# Altium schematic sheet led.SchDoc
size A4; SheetNumber: 9; SheetTotal: 12
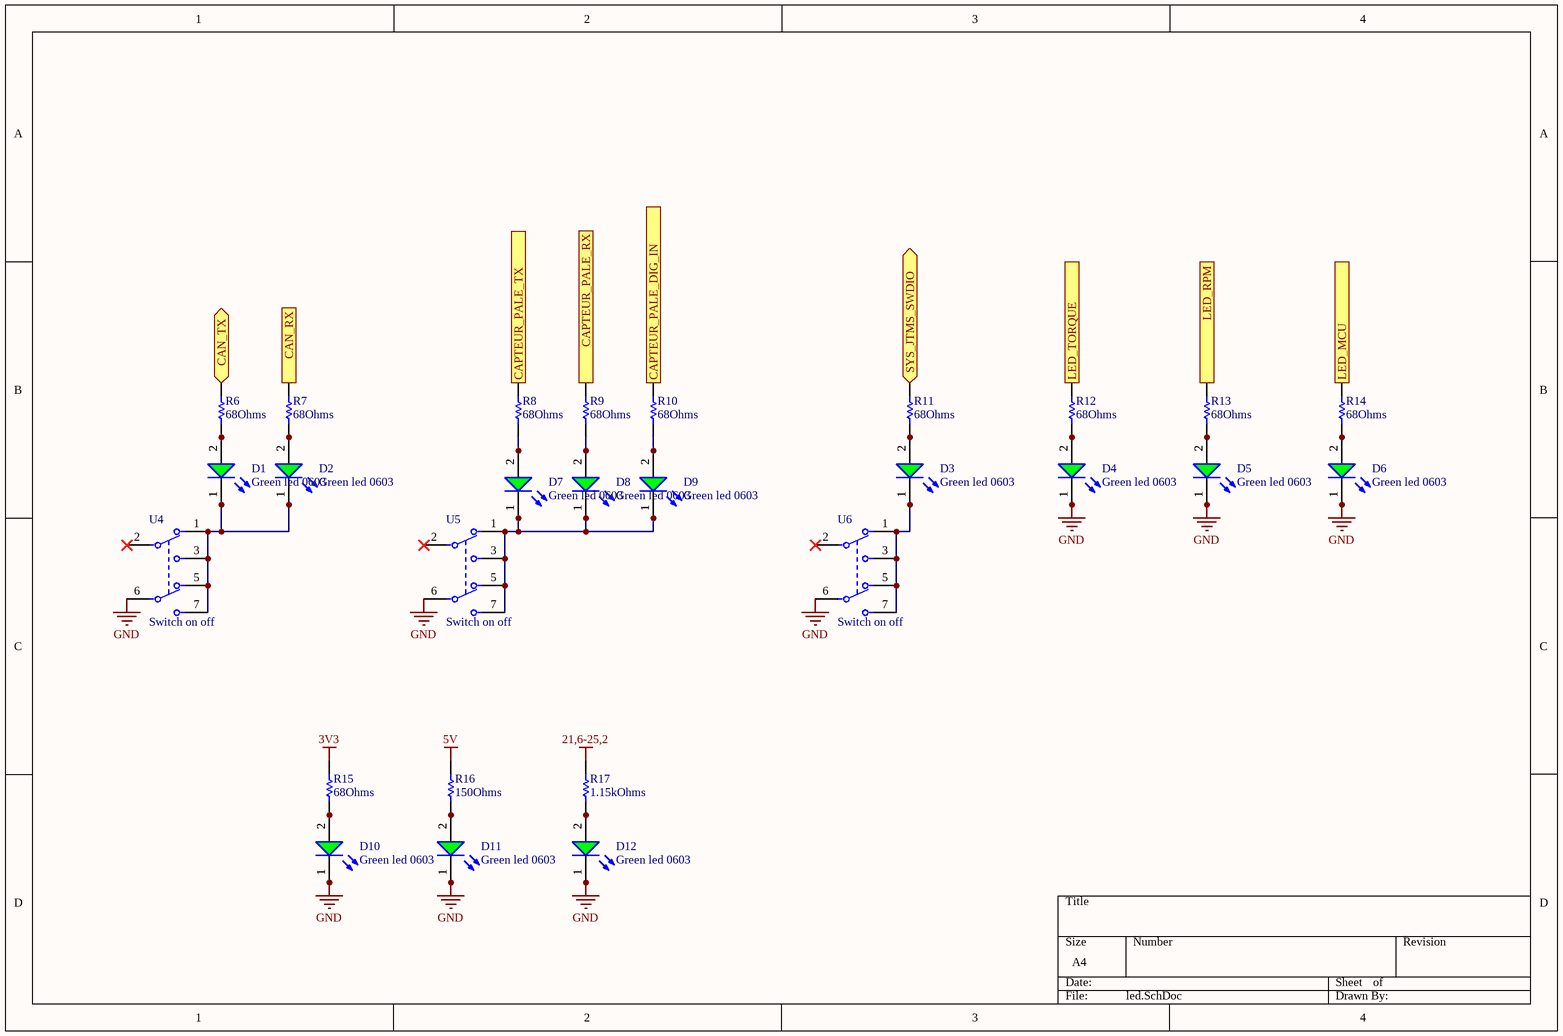
[diagram p0: led.SchDoc]

## Parts
D1  Green led 0603  [WL-SMCW_0603_150060xx75000]
D2  Green led 0603  [WL-SMCW_0603_150060xx75000]
D3  Green led 0603  [WL-SMCW_0603_150060xx75000]
D4  Green led 0603  [WL-SMCW_0603_150060xx75000]
D5  Green led 0603  [WL-SMCW_0603_150060xx75000]
D6  Green led 0603  [WL-SMCW_0603_150060xx75000]
D7  Green led 0603  [WL-SMCW_0603_150060xx75000]
D8  Green led 0603  [WL-SMCW_0603_150060xx75000]
D9  Green led 0603  [WL-SMCW_0603_150060xx75000]
D10  Green led 0603  [WL-SMCW_0603_150060xx75000]
D11  Green led 0603  [WL-SMCW_0603_150060xx75000]
D12  Green led 0603  [WL-SMCW_0603_150060xx75000]
R6  68Ohms  [RESC1005X40X25LL05T10]
R7  68Ohms  [RESC1005X40X25LL05T10]
R8  68Ohms  [RESC1005X40X25LL05T10]
R9  68Ohms  [RESC1005X40X25LL05T10]
R10  68Ohms  [RESC1005X40X25LL05T10]
R11  68Ohms  [RESC1005X40X25LL05T10]
R12  68Ohms  [RESC1005X40X25LL05T10]
R13  68Ohms  [RESC1005X40X25LL05T10]
R14  68Ohms  [RESC1005X40X25LL05T10]
R15  68Ohms  [RESC1005X40X25LL05T10]
R16  150Ohms  [RESC1005X40X25LL05T10]
R17  1.15kOhms  [RESC1005X40X25NL05T10]
U4  Switch on off  [FP-JS202011JCQN-MFG]
U5  Switch on off  [FP-JS202011JCQN-MFG]
U6  Switch on off  [FP-JS202011JCQN-MFG]

## Ports
CAN_RX, CAN_TX (bidir), CAPTEUR_PALE_DIG_IN (out), CAPTEUR_PALE_RX, CAPTEUR_PALE_TX (out), LED_MCU (out), LED_RPM (out), LED_TORQUE (out), SYS_JTMS_SWDIO (bidir)

## Nets
3V3: R15.2
5V: R16.2
21,6-25,2: R17.2
GND: D4.1(K) D5.1(K) D6.1(K) D10.1(K) D11.1(K) D12.1(K) U4.6(2_C) U5.6(2_C) U6.6(2_C)
CAN_RX: R7.2 ; port CAN_RX
CAN_TX: R6.2 ; port CAN_TX
CAPTEUR_PALE_DIG_IN: R10.2 ; port CAPTEUR_PALE_DIG_IN
CAPTEUR_PALE_RX: R9.2 ; port CAPTEUR_PALE_RX
CAPTEUR_PALE_TX: R8.2 ; port CAPTEUR_PALE_TX
LED_MCU: R14.2 ; port LED_MCU
LED_RPM: R13.2 ; port LED_RPM
LED_TORQUE: R12.2 ; port LED_TORQUE
SYS_JTMS_SWDIO: R11.2 ; port SYS_JTMS_SWDIO
NetD1_1: D1.1(K) D2.1(K) U4.1 U4.3 U4.5 U4.7
NetD1_2: D1.2(A) R6.1
NetD2_2: D2.2(A) R7.1
NetD3_1: D3.1(K) U6.1 U6.3 U6.5 U6.7
NetD3_2: D3.2(A) R11.1
NetD4_2: D4.2(A) R12.1
NetD5_2: D5.2(A) R13.1
NetD6_2: D6.2(A) R14.1
NetD7_1: D7.1(K) D8.1(K) D9.1(K) U5.1 U5.3 U5.5 U5.7
NetD7_2: D7.2(A) R8.1
NetD8_2: D8.2(A) R9.1
NetD9_2: D9.2(A) R10.1
NetD10_2: D10.2(A) R15.1
NetD11_2: D11.2(A) R16.1
NetD12_2: D12.2(A) R17.1

Not connected (* = marked no-connect by the designer): U4 2(1_C)*; U5 2(1_C)*; U6 2(1_C)*

## Library data of the parts
D1-D12 = 150060VS75000: WURTH ELEKTRONIK - 150060VS75000 - LED, Green, SMD, 0603, 30 mA, 2 V, 570 nm; Manufacturer: Wurth Electronics; Lens Color: Colorless; Luminous Intensity: 40mcd; Viewing Angle: 140°; Forward Voltage: 2V; Lens Style: Rectangular,Flat; Forward Current: 20mA; Dominant Wavelength: 570nm; Lens Transparency: Clear; Power Rating: 72mW; Reverse Voltage (DC): 5V; Lens Size: 0.7mm; Supplier: Digikey; Supplier Part Number: 732-4980-1-ND; Manufacturer Part Number: 150060VS75000; RoHS: Yes; Category: LEDs; Stock: 75022; Pricing: 1=0.15, 50=0.142, 100=0.122, 500=0.105, 1000=0.10125 (USD); Mounting Technology: Surface Mount; Case/Package: 0603; Pins: 2; Color: Green; Case Code (Metric): 1608; Case Code (Imperial): 0603; Weight: 0.000882oz; Min Operating Temperature: -40°C; Max Operating Temperature: 85°C; Package Quantity: 4000; Packaging: Cut Tape; Test Current: 20mA; Illumination Color: Green; Series: WL-SMCW; Max Reverse Voltage (DC): 5V; Power Dissipation: 72mW; Reverse Voltage: 5V; Length: 1.6mm; Width: 0.8mm; Height: 0.8mm; RoHS Compliant: Yes; Reach SVHC Compliant: 4187SVHC; ComponentLink1URL: https://datasheet.ciiva.com/29562/150060vs75000-29562919.pdf?src-supplier=Digikey; ComponentLink1Description: https://datasheet.ciiva.com/29562/150060vs75000-29562919.pdf?src-supplier=Digikey
R6-R15 = RC0402FR-0768RL: SMD Chip Resistor, 68 Ohm, ± 1%, 63 mW, 0402 [1005 Metric], Thick Film, General Purpose; Manufacturer: Yageo; Value: 68R; Power Rating: 63mW; Voltage Rating: 50V; Temperature Coefficient: 100ppm/°C; Supplier: Digikey; Supplier Part Number: 311-68.0LRCT-ND; Manufacturer Part Number: RC0402FR-0768RL; RoHS: Yes; Category: Chip SMD Resistors; Stock: 982905; Pricing: 1=0.1, 10=0.015, 50=0.0088, 100=0.0073, 500=0.00488, 1000=0.00417, 5000=0.00297 (USD); Case/Package: 0402; Case Code (Metric): 1005; Case Code (Imperial): 0402; Min Operating Temperature: -55°C; Max Operating Temperature: 155°C; Tolerance: 1%; Package Quantity: 1; Packaging: Tape and Reel; Resistor Type: Thick Film; Number of Terminations: 2; Termination: SMD/SMT; Max Power Dissipation: 63mW; Features: Moisture Resistant; Series: RC; Resistance Tolerance: 1%; Construction: Rectangular; Voltage Rating (AC): 50V; Length: 0.039inch; Width: 0.02inch; Height: 0.016inch; Depth: 0.5mm; Reach SVHC Compliant: No; Military Standard: Not; Lead Free: Lead Free; RoHS Compliant: Yes; ComponentLink1URL: https://datasheet.ciiva.com/2453/pyu-r-int-thick-7-2453524.pdf?src-supplier=Digikey; ComponentLink1Description: https://datasheet.ciiva.com/2453/pyu-r-int-thick-7-2453524.pdf?src-supplier=Digikey; ComponentLink2URL: https://datasheet.ciiva.com/2453/pyu-r-int-thick-7-2453525.pdf?src-supplier=Digikey; ComponentLink2Description: https://datasheet.ciiva.com/2453/pyu-r-int-thick-7-2453525.pdf?src-supplier=Digikey; ComponentLink3URL: https://datasheet.ciiva.com/2453/pyu-r-int-thick-7-2453523.pdf?src-supplier=Digikey; ComponentLink3Description: https://datasheet.ciiva.com/2453/pyu-r-int-thick-7-2453523.pdf?src-supplier=Digikey; ComponentLink4URL: https://datasheet.ciiva.com/5558/pyu-rc0402-51-rohs-l-6-r-5558023.pdf?src-supplier=Mouser; ComponentLink4Description: https://datasheet.ciiva.com/5558/pyu-rc0402-51-rohs-l-6-r-5558023.pdf?src-supplier=Mouser; ComponentLink5URL: https://datasheet.ciiva.com/7850/1018594-7850074.pdf?src-supplier=Element14; ComponentLink5Description: https://datasheet.ciiva.com/7850/1018594-7850074.pdf?src-supplier=Element14; ComponentLink6URL: https://datasheet.ciiva.com/7850/1018594-7850075.pdf?src-supplier=Element14; ComponentLink6Description: https://datasheet.ciiva.com/7850/1018594-7850075.pdf?src-supplier=Element14; ComponentLink7URL: https://datasheet.ciiva.com/15189/getdatasheetpartid-325392-15189501.pdf?src-supplier=Verical; ComponentLink7Description: https://datasheet.ciiva.com/15189/getdatasheetpartid-325392-15189501.pdf?src-supplier=Verical
R16 = RC0402FR-07150RL: SMD Chip Resistor, 150 Ohm, ± 1%, 63 mW, 0402 [1005 Metric], Thick Film, General Purpose; Manufacturer: Yageo; Value: 150R; Power Rating: 63mW; Voltage Rating: 50V; Temperature Coefficient: 100ppm/°C; Supplier: Digikey; Supplier Part Number: 311-150LRCT-ND; Manufacturer Part Number: RC0402FR-07150RL; RoHS: Yes; Category: Chip SMD Resistors; Stock: 5570890; Pricing: 1=0.1, 10=0.015, 50=0.0088, 100=0.0073, 500=0.00488, 1000=0.00417, 5000=0.00297 (USD); Case/Package: 0402; Case Code (Metric): 1005; Case Code (Imperial): 0402; Min Operating Temperature: -55°C; Max Operating Temperature: 155°C; Tolerance: 1%; Packaging: Tape and Reel; Package Quantity: 1; Resistor Type: Thick Film; Number of Terminations: 2; Termination: SMD/SMT; Max Power Dissipation: 63mW; Working Voltage: 50V; Features: Moisture Resistant; Series: RC; Resistance Tolerance: 1%; Construction: Rectangular; Technology: THICK FILM; Voltage Rating (AC): 50V; Length: 0.039inch; Width: 0.02inch; Height: 0.016inch; Depth: 0.5mm; Military Standard: Not; Lead Free: Lead Free; RoHS Compliant: Yes; Reach SVHC Compliant: Unknown; ComponentLink1URL: https://datasheet.ciiva.com/11808/0900766b80c66297-11808422.pdf?src-supplier=Rs; ComponentLink1Description: https://datasheet.ciiva.com/11808/0900766b80c66297-11808422.pdf?src-supplier=Rs; ComponentLink2URL: https://datasheet.ciiva.com/5558/pyu-rc0402-51-rohs-l-6-r-5558110.pdf?src-supplier=Mouser; ComponentLink2Description: https://datasheet.ciiva.com/5558/pyu-rc0402-51-rohs-l-6-r-5558110.pdf?src-supplier=Mouser
R17 = RC0402FR-071K15L: SMD Chip Resistor, 1.15 kOhm, ± 1%, 63 mW, 0402 [1005 Metric], Thick Film, General Purpose; Manufacturer: Yageo; Value: 1.15kR; Temperature Coefficient: 100ppm/°C; Power Rating: 62.5mW; Voltage Rating: 50V; Max Power Dissipation: 63mW; Supplier: Digikey; Supplier Part Number: YAG3033CT-ND; Manufacturer Part Number: RC0402FR-071K15L; RoHS: Yes; Category: Chip SMD Resistors; Stock: 290462; Pricing: 1=0.1, 10=0.015, 50=0.0088, 100=0.0073, 500=0.00488, 1000=0.00417, 5000=0.00297 (USD); Case/Package: 0402; Contact Plating: Tin,Lead; Case Code (Imperial): 0402; Case Code (Metric): 1005; Min Operating Temperature: -55°C; Max Operating Temperature: 155°C; Tolerance: 1%; Packaging: Tape and Reel; Number of Terminations: 2; Termination: SMD/SMT; Voltage Rating (DC): 50V; Features: Moisture Resistant; Series: RC; Construction: Rectangular; Length: 1mm; Width: 0.5mm; Height: 0.016inch; Depth: 0.5mm; Military Standard: Not; Lead Free: Lead Free; RoHS Compliant: Yes; ComponentLink1URL: https://datasheet.ciiva.com/8895/pyu-rc0402-51-rohs-l-6-8895884.pdf?src-supplier=Avnet; ComponentLink1Description: https://datasheet.ciiva.com/8895/pyu-rc0402-51-rohs-l-6-8895884.pdf?src-supplier=Avnet; ComponentLink2URL: https://datasheet.ciiva.com/26829/getdatasheetpartid-326427-26829948.pdf?src-supplier=Verical; ComponentLink2Description: https://datasheet.ciiva.com/26829/getdatasheetpartid-326427-26829948.pdf?src-supplier=Verical
U4-U6 = JS202011JCQN: SWITCH SLIDE DPDT 300mA 6V; Manufacturer: ITT C&K; Actuator Material: Nylon,Polyamide,PA46; Switch Function: On-On; Actuator Type: Standard; Switch Travel: 2mm; Electrical Life: 5000Cycles; Supplier: Digikey; Supplier Part Number: CKN10723CT-ND; Manufacturer Part Number: JS202011JCQN; RoHS: No; Category: Slide Switches; Stock: 20641; Pricing: 1=0.8, 10=0.769, 25=0.74, 100=0.6422, 250=0.58596, 500=0.54452 (USD); Mounting Technology: Surface Mount; Contact Material: Copper Alloy; Contact Plating: Silver; Min Operating Temperature: -40°C; Max Operating Temperature: 85°C; Throw Configuration: DPDT; Packaging: Cut Tape; Voltage Rating (DC): 6V; Series: JS; Actuator Length: 2mm; ComponentLink1URL: http://www.farnell.com/datasheets/2674788.pdf?src-supplier=Farnell; ComponentLink1Description: http://www.farnell.com/datasheets/2674788.pdf?src-supplier=Farnell; ComponentLink2URL: http://www.farnell.com/datasheets/2674788.pdf?src-supplier=Element14; ComponentLink2Description: http://www.farnell.com/datasheets/2674788.pdf?src-supplier=Element14; ComponentLink3URL: https://datasheet.octopart.com/JS202011JCQN-C%26K-Components-datasheet-67873653.pdf?src-supplier=Newark; ComponentLink3Description: https://datasheet.octopart.com/JS202011JCQN-C%26K-Components-datasheet-67873653.pdf?src-supplier=Newark; ComponentLink4URL: http://www.farnell.com/datasheets/2674788.pdf?src-supplier=Newark; ComponentLink4Description: http://www.farnell.com/datasheets/2674788.pdf?src-supplier=Newark; ComponentLink5URL: https://www.ckswitches.com/media/1422/js.pdf?src-supplier=Digikey; ComponentLink5Description: https://www.ckswitches.com/media/1422/js.pdf?src-supplier=Digikey; ComponentLink6URL: https://datasheet.octopart.com/JS202011JCQN-C%26K-Components-datasheet-138126065.pdf?src-supplier=TME; ComponentLink6Description: https://datasheet.octopart.com/JS202011JCQN-C%26K-Components-datasheet-138126065.pdf?src-supplier=TME